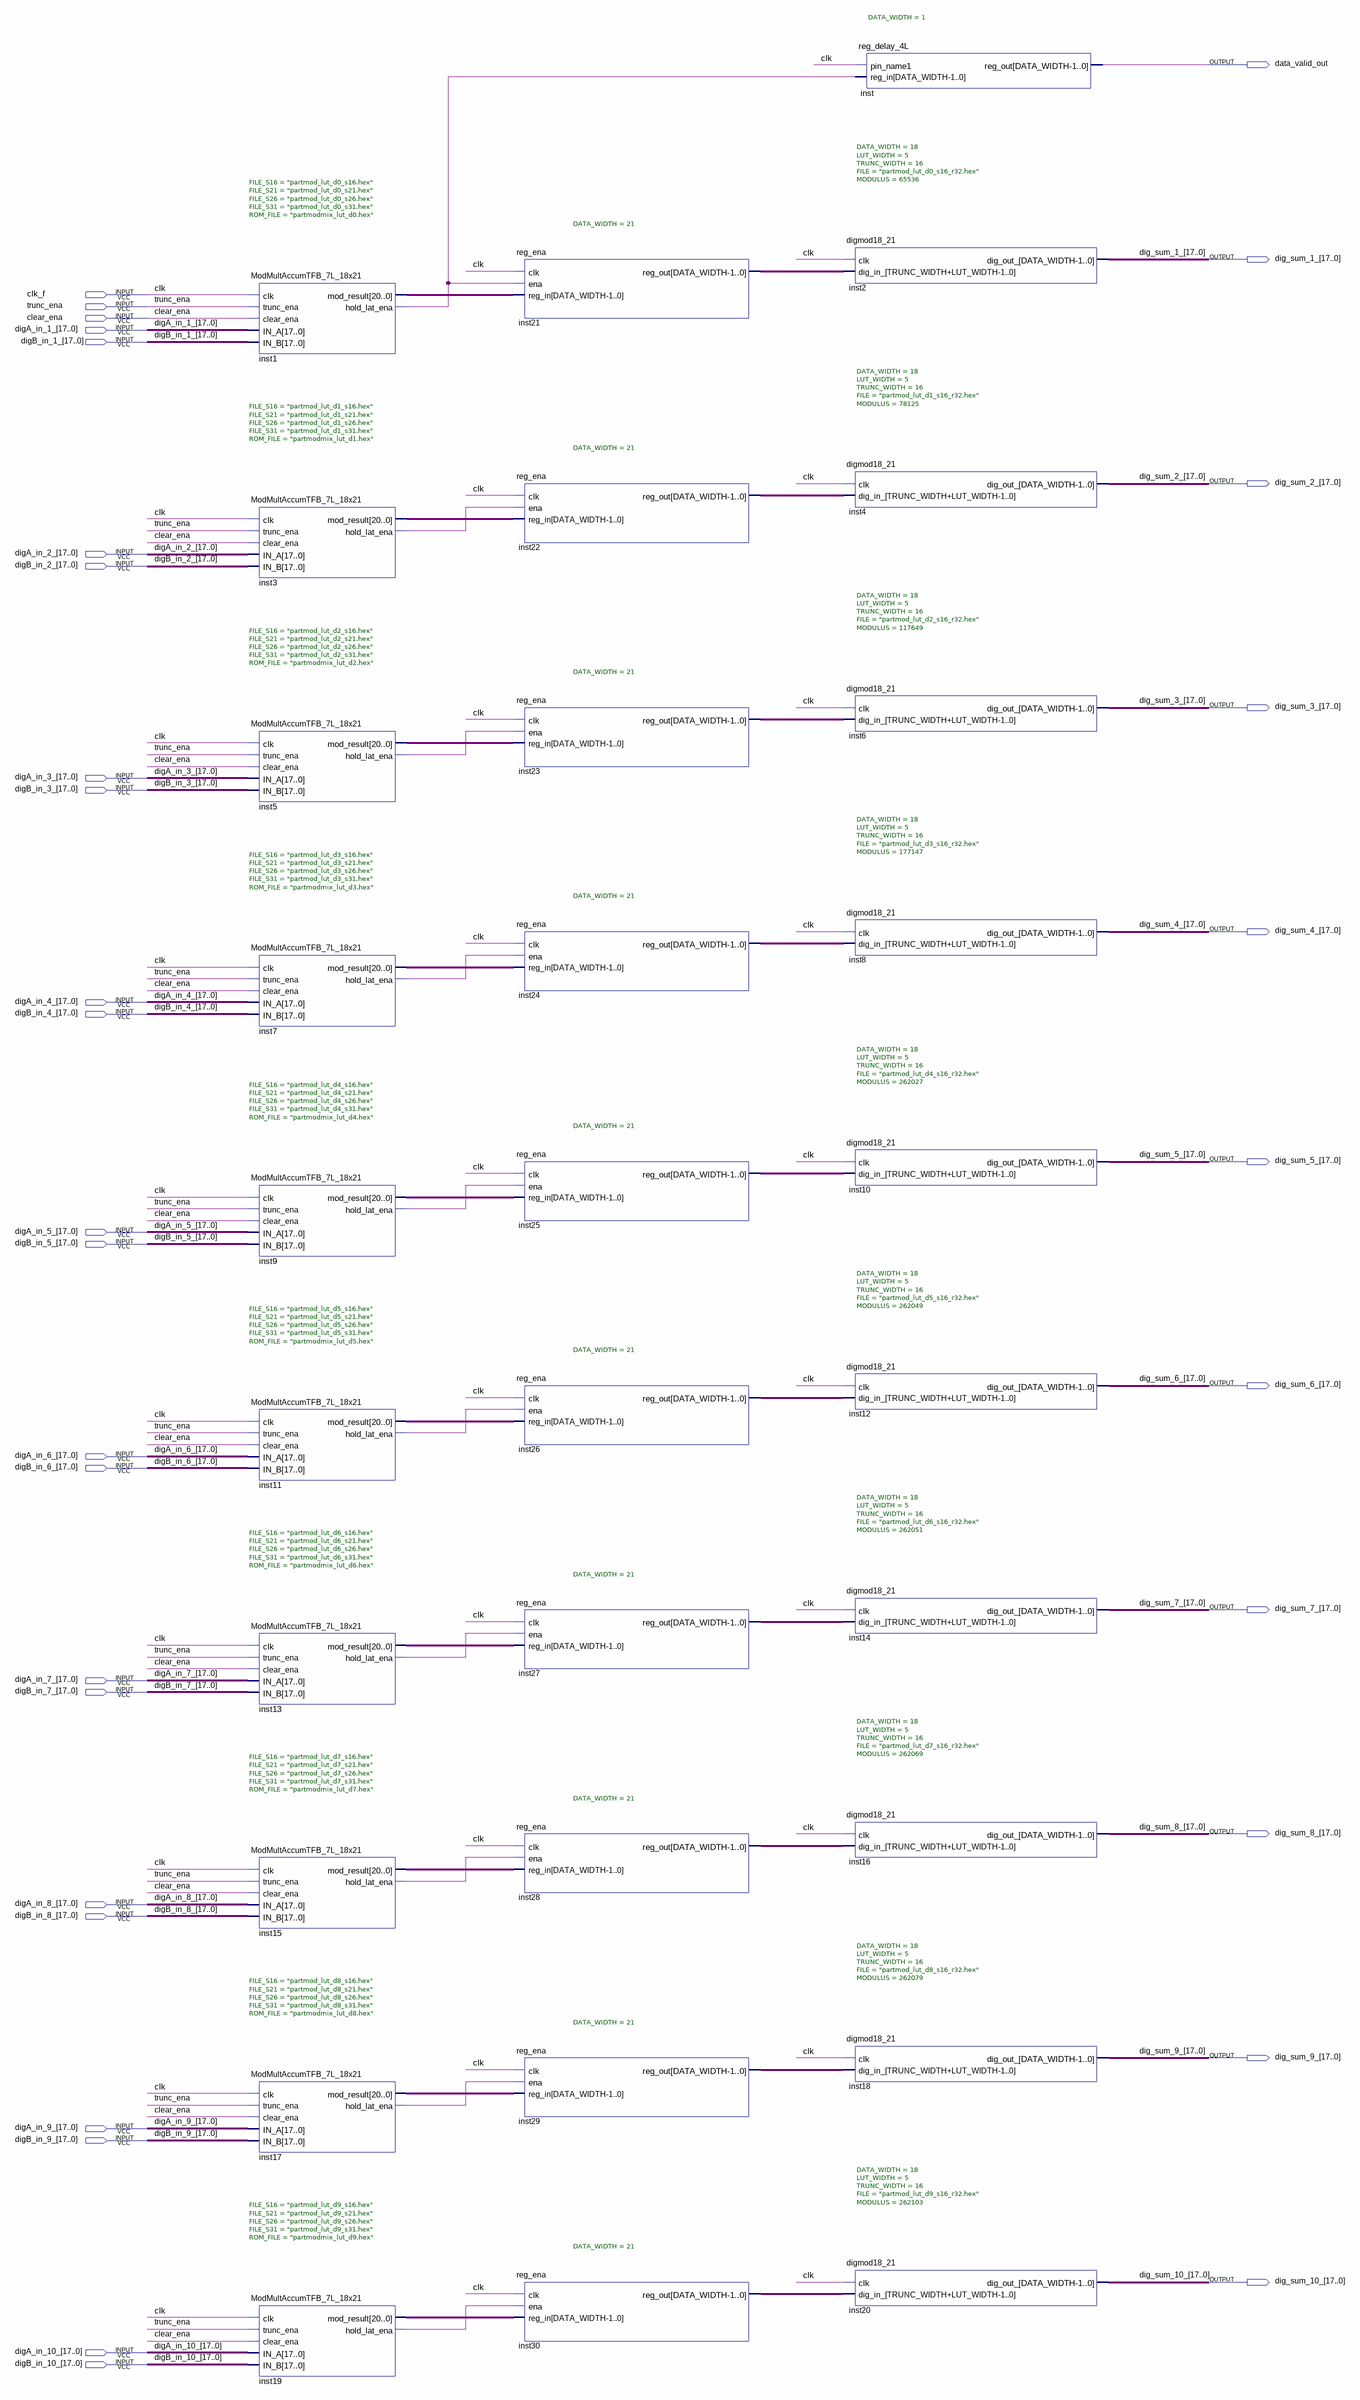
[diagram p0: schematic sheet]
// Quartus schematic ec_prod_sum_test.bdf as structural Verilog: 31 symbols, 34 pins
module ec_prod_sum_test (
  input  clk_f,
  input  trunc_ena,
  input  clear_ena,
  input  [17:0] digA_in_1_,
  input  [17:0] digB_in_1_,
  input  [17:0] digA_in_2_,
  input  [17:0] digB_in_2_,
  input  [17:0] digA_in_3_,
  input  [17:0] digB_in_3_,
  input  [17:0] digA_in_4_,
  input  [17:0] digB_in_4_,
  input  [17:0] digA_in_5_,
  input  [17:0] digB_in_5_,
  input  [17:0] digA_in_6_,
  input  [17:0] digB_in_6_,
  input  [17:0] digA_in_7_,
  input  [17:0] digB_in_7_,
  input  [17:0] digA_in_8_,
  input  [17:0] digB_in_8_,
  input  [17:0] digA_in_9_,
  input  [17:0] digB_in_9_,
  input  [17:0] digA_in_10_,
  input  [17:0] digB_in_10_,
  output data_valid_out,
  output [17:0] dig_sum_1_,
  output [17:0] dig_sum_2_,
  output [17:0] dig_sum_3_,
  output [17:0] dig_sum_4_,
  output [17:0] dig_sum_5_,
  output [17:0] dig_sum_6_,
  output [17:0] dig_sum_7_,
  output [17:0] dig_sum_8_,
  output [17:0] dig_sum_9_,
  output [17:0] dig_sum_10_
);

  wire inst1_hold_lat_ena, inst3_hold_lat_ena, inst5_hold_lat_ena, inst7_hold_lat_ena, inst9_hold_lat_ena,
       inst11_hold_lat_ena, inst13_hold_lat_ena, inst15_hold_lat_ena, inst17_hold_lat_ena,
       inst19_hold_lat_ena;
  wire [20:0] inst1_mod_result, inst3_mod_result, inst5_mod_result, inst7_mod_result, inst9_mod_result,
       inst11_mod_result, inst13_mod_result, inst15_mod_result, inst17_mod_result, inst19_mod_result,
       inst21_reg_out, inst22_reg_out, inst23_reg_out, inst24_reg_out, inst25_reg_out, inst26_reg_out,
       inst27_reg_out, inst28_reg_out, inst29_reg_out, inst30_reg_out;

  ModMultAccumTFB_7L_18x21 #(.FILE_S16("partmod_lut_d0_s16.hex"), .FILE_S21("partmod_lut_d0_s21.hex"), .FILE_S26("partmod_lut_d0_s26.hex"), .FILE_S31("partmod_lut_d0_s31.hex"), .ROM_FILE("partmodmix_lut_d0.hex")) inst1 (
    .clk(clk_f), .trunc_ena(trunc_ena), .clear_ena(clear_ena), .IN_A(digA_in_1_), .IN_B(digB_in_1_),
    .hold_lat_ena(inst1_hold_lat_ena), .mod_result(inst1_mod_result));
  ModMultAccumTFB_7L_18x21 #(.FILE_S16("partmod_lut_d1_s16.hex"), .FILE_S21("partmod_lut_d1_s21.hex"), .FILE_S26("partmod_lut_d1_s26.hex"), .FILE_S31("partmod_lut_d1_s31.hex"), .ROM_FILE("partmodmix_lut_d1.hex")) inst3 (
    .clk(clk_f), .trunc_ena(trunc_ena), .clear_ena(clear_ena), .IN_A(digA_in_2_), .IN_B(digB_in_2_),
    .hold_lat_ena(inst3_hold_lat_ena), .mod_result(inst3_mod_result));
  ModMultAccumTFB_7L_18x21 #(.FILE_S16("partmod_lut_d2_s16.hex"), .FILE_S21("partmod_lut_d2_s21.hex"), .FILE_S26("partmod_lut_d2_s26.hex"), .FILE_S31("partmod_lut_d2_s31.hex"), .ROM_FILE("partmodmix_lut_d2.hex")) inst5 (
    .clk(clk_f), .trunc_ena(trunc_ena), .clear_ena(clear_ena), .IN_A(digA_in_3_), .IN_B(digB_in_3_),
    .hold_lat_ena(inst5_hold_lat_ena), .mod_result(inst5_mod_result));
  ModMultAccumTFB_7L_18x21 #(.FILE_S16("partmod_lut_d3_s16.hex"), .FILE_S21("partmod_lut_d3_s21.hex"), .FILE_S26("partmod_lut_d3_s26.hex"), .FILE_S31("partmod_lut_d3_s31.hex"), .ROM_FILE("partmodmix_lut_d3.hex")) inst7 (
    .clk(clk_f), .trunc_ena(trunc_ena), .clear_ena(clear_ena), .IN_A(digA_in_4_), .IN_B(digB_in_4_),
    .hold_lat_ena(inst7_hold_lat_ena), .mod_result(inst7_mod_result));
  ModMultAccumTFB_7L_18x21 #(.FILE_S16("partmod_lut_d4_s16.hex"), .FILE_S21("partmod_lut_d4_s21.hex"), .FILE_S26("partmod_lut_d4_s26.hex"), .FILE_S31("partmod_lut_d4_s31.hex"), .ROM_FILE("partmodmix_lut_d4.hex")) inst9 (
    .clk(clk_f), .trunc_ena(trunc_ena), .clear_ena(clear_ena), .IN_A(digA_in_5_), .IN_B(digB_in_5_),
    .hold_lat_ena(inst9_hold_lat_ena), .mod_result(inst9_mod_result));
  ModMultAccumTFB_7L_18x21 #(.FILE_S16("partmod_lut_d5_s16.hex"), .FILE_S21("partmod_lut_d5_s21.hex"), .FILE_S26("partmod_lut_d5_s26.hex"), .FILE_S31("partmod_lut_d5_s31.hex"), .ROM_FILE("partmodmix_lut_d5.hex")) inst11 (
    .clk(clk_f), .trunc_ena(trunc_ena), .clear_ena(clear_ena), .IN_A(digA_in_6_), .IN_B(digB_in_6_),
    .hold_lat_ena(inst11_hold_lat_ena), .mod_result(inst11_mod_result));
  ModMultAccumTFB_7L_18x21 #(.FILE_S16("partmod_lut_d6_s16.hex"), .FILE_S21("partmod_lut_d6_s21.hex"), .FILE_S26("partmod_lut_d6_s26.hex"), .FILE_S31("partmod_lut_d6_s31.hex"), .ROM_FILE("partmodmix_lut_d6.hex")) inst13 (
    .clk(clk_f), .trunc_ena(trunc_ena), .clear_ena(clear_ena), .IN_A(digA_in_7_), .IN_B(digB_in_7_),
    .hold_lat_ena(inst13_hold_lat_ena), .mod_result(inst13_mod_result));
  ModMultAccumTFB_7L_18x21 #(.FILE_S16("partmod_lut_d7_s16.hex"), .FILE_S21("partmod_lut_d7_s21.hex"), .FILE_S26("partmod_lut_d7_s26.hex"), .FILE_S31("partmod_lut_d7_s31.hex"), .ROM_FILE("partmodmix_lut_d7.hex")) inst15 (
    .clk(clk_f), .trunc_ena(trunc_ena), .clear_ena(clear_ena), .IN_A(digA_in_8_), .IN_B(digB_in_8_),
    .hold_lat_ena(inst15_hold_lat_ena), .mod_result(inst15_mod_result));
  ModMultAccumTFB_7L_18x21 #(.FILE_S16("partmod_lut_d8_s16.hex"), .FILE_S21("partmod_lut_d8_s21.hex"), .FILE_S26("partmod_lut_d8_s26.hex"), .FILE_S31("partmod_lut_d8_s31.hex"), .ROM_FILE("partmodmix_lut_d8.hex")) inst17 (
    .clk(clk_f), .trunc_ena(trunc_ena), .clear_ena(clear_ena), .IN_A(digA_in_9_), .IN_B(digB_in_9_),
    .hold_lat_ena(inst17_hold_lat_ena), .mod_result(inst17_mod_result));
  ModMultAccumTFB_7L_18x21 #(.FILE_S16("partmod_lut_d9_s16.hex"), .FILE_S21("partmod_lut_d9_s21.hex"), .FILE_S26("partmod_lut_d9_s26.hex"), .FILE_S31("partmod_lut_d9_s31.hex"), .ROM_FILE("partmodmix_lut_d9.hex")) inst19 (
    .clk(clk_f), .trunc_ena(trunc_ena), .clear_ena(clear_ena), .IN_A(digA_in_10_), .IN_B(digB_in_10_),
    .hold_lat_ena(inst19_hold_lat_ena), .mod_result(inst19_mod_result));
  reg_ena #(.DATA_WIDTH(21)) inst21 (
    .clk(clk_f), .ena(inst1_hold_lat_ena), .reg_in(inst1_mod_result), .reg_out(inst21_reg_out));
  reg_ena #(.DATA_WIDTH(21)) inst22 (
    .clk(clk_f), .ena(inst3_hold_lat_ena), .reg_in(inst3_mod_result), .reg_out(inst22_reg_out));
  reg_ena #(.DATA_WIDTH(21)) inst23 (
    .clk(clk_f), .ena(inst5_hold_lat_ena), .reg_in(inst5_mod_result), .reg_out(inst23_reg_out));
  reg_ena #(.DATA_WIDTH(21)) inst24 (
    .clk(clk_f), .ena(inst7_hold_lat_ena), .reg_in(inst7_mod_result), .reg_out(inst24_reg_out));
  reg_ena #(.DATA_WIDTH(21)) inst25 (
    .clk(clk_f), .ena(inst9_hold_lat_ena), .reg_in(inst9_mod_result), .reg_out(inst25_reg_out));
  reg_ena #(.DATA_WIDTH(21)) inst26 (
    .clk(clk_f), .ena(inst11_hold_lat_ena), .reg_in(inst11_mod_result), .reg_out(inst26_reg_out));
  reg_ena #(.DATA_WIDTH(21)) inst27 (
    .clk(clk_f), .ena(inst13_hold_lat_ena), .reg_in(inst13_mod_result), .reg_out(inst27_reg_out));
  reg_ena #(.DATA_WIDTH(21)) inst28 (
    .clk(clk_f), .ena(inst15_hold_lat_ena), .reg_in(inst15_mod_result), .reg_out(inst28_reg_out));
  reg_ena #(.DATA_WIDTH(21)) inst29 (
    .clk(clk_f), .ena(inst17_hold_lat_ena), .reg_in(inst17_mod_result), .reg_out(inst29_reg_out));
  reg_ena #(.DATA_WIDTH(21)) inst30 (
    .clk(clk_f), .ena(inst19_hold_lat_ena), .reg_in(inst19_mod_result), .reg_out(inst30_reg_out));
  reg_delay_4L #(.DATA_WIDTH(1)) inst (.pin_name1(clk_f), .reg_in(inst1_hold_lat_ena), .reg_out(data_valid_out));
  digmod18_21 #(.DATA_WIDTH(18), .LUT_WIDTH(5), .TRUNC_WIDTH(16), .FILE("partmod_lut_d0_s16_r32.hex"), .MODULUS(65536)) inst2 (
    .clk(clk_f), .dig_in_(inst21_reg_out), .dig_out_(dig_sum_1_));
  digmod18_21 #(.DATA_WIDTH(18), .LUT_WIDTH(5), .TRUNC_WIDTH(16), .FILE("partmod_lut_d1_s16_r32.hex"), .MODULUS(78125)) inst4 (
    .clk(clk_f), .dig_in_(inst22_reg_out), .dig_out_(dig_sum_2_));
  digmod18_21 #(.DATA_WIDTH(18), .LUT_WIDTH(5), .TRUNC_WIDTH(16), .FILE("partmod_lut_d2_s16_r32.hex"), .MODULUS(117649)) inst6 (
    .clk(clk_f), .dig_in_(inst23_reg_out), .dig_out_(dig_sum_3_));
  digmod18_21 #(.DATA_WIDTH(18), .LUT_WIDTH(5), .TRUNC_WIDTH(16), .FILE("partmod_lut_d3_s16_r32.hex"), .MODULUS(177147)) inst8 (
    .clk(clk_f), .dig_in_(inst24_reg_out), .dig_out_(dig_sum_4_));
  digmod18_21 #(.DATA_WIDTH(18), .LUT_WIDTH(5), .TRUNC_WIDTH(16), .FILE("partmod_lut_d4_s16_r32.hex"), .MODULUS(262027)) inst10 (
    .clk(clk_f), .dig_in_(inst25_reg_out), .dig_out_(dig_sum_5_));
  digmod18_21 #(.DATA_WIDTH(18), .LUT_WIDTH(5), .TRUNC_WIDTH(16), .FILE("partmod_lut_d5_s16_r32.hex"), .MODULUS(262049)) inst12 (
    .clk(clk_f), .dig_in_(inst26_reg_out), .dig_out_(dig_sum_6_));
  digmod18_21 #(.DATA_WIDTH(18), .LUT_WIDTH(5), .TRUNC_WIDTH(16), .FILE("partmod_lut_d6_s16_r32.hex"), .MODULUS(262051)) inst14 (
    .clk(clk_f), .dig_in_(inst27_reg_out), .dig_out_(dig_sum_7_));
  digmod18_21 #(.DATA_WIDTH(18), .LUT_WIDTH(5), .TRUNC_WIDTH(16), .FILE("partmod_lut_d7_s16_r32.hex"), .MODULUS(262069)) inst16 (
    .clk(clk_f), .dig_in_(inst28_reg_out), .dig_out_(dig_sum_8_));
  digmod18_21 #(.DATA_WIDTH(18), .LUT_WIDTH(5), .TRUNC_WIDTH(16), .FILE("partmod_lut_d8_s16_r32.hex"), .MODULUS(262079)) inst18 (
    .clk(clk_f), .dig_in_(inst29_reg_out), .dig_out_(dig_sum_9_));
  digmod18_21 #(.DATA_WIDTH(18), .LUT_WIDTH(5), .TRUNC_WIDTH(16), .FILE("partmod_lut_d9_s16_r32.hex"), .MODULUS(262103)) inst20 (
    .clk(clk_f), .dig_in_(inst30_reg_out), .dig_out_(dig_sum_10_));

  // Other names for the same wires on the sheet: clk = clk_f
endmodule
